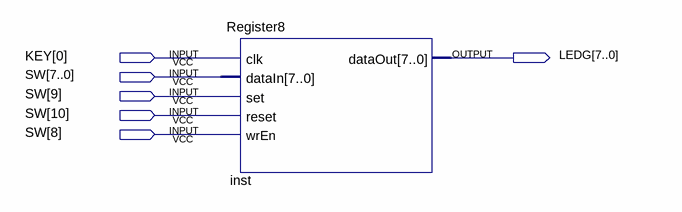
[diagram p0: schematic sheet]
// Quartus schematic Register_Demo.bdf as structural Verilog: 1 symbols, 6 pins
module Register_Demo (
  input  [0:0] KEY,
  input  [10:0] SW,
  output [7:0] LEDG
);

  Register8 inst (.clk(KEY[0]), .dataIn(SW[7:0]), .set(SW[9]), .reset(SW[10]), .wrEn(SW[8]), .dataOut(LEDG));
endmodule
